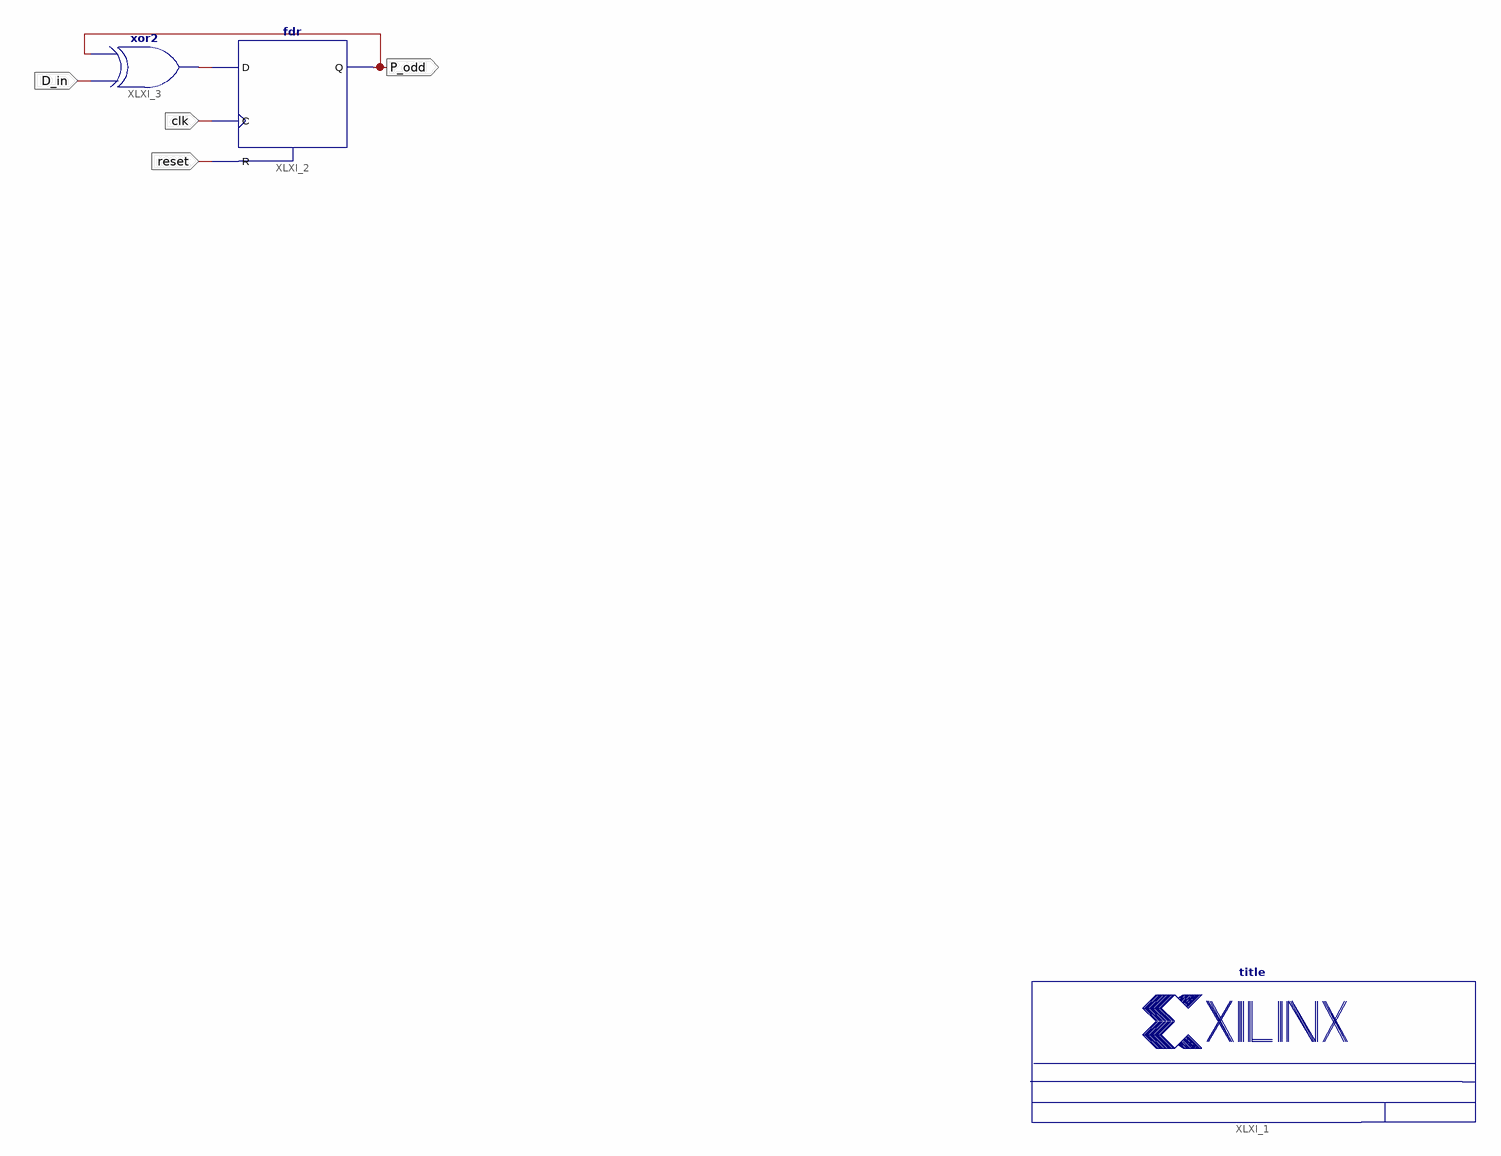
[diagram p0: schematic sheet 1]
// Xilinx ISE schematic fig_p5_15.sch (spartan3e) as structural Verilog: 3 symbols, 4 ports
module fig_p5_15 (
  input  clk,
  input  reset,
  input  D_in,
  output P_odd
);

  wire XLXN_1;

  title #(.TitleFieldText("Odd numbers - TFF from XOR and DFF"), .NameFieldText("Figure P5.15")) XLXI_1 ();
  fdr XLXI_2 (.C(clk), .D(XLXN_1), .R(reset), .Q(P_odd));
  xor XLXI_3 (XLXN_1, D_in, P_odd);
endmodule
